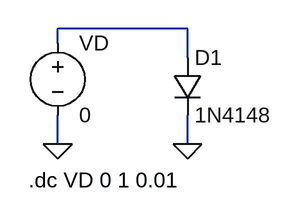
[diagram p0: schematic diode_transfer.asc]
diode_transfer.asc, the LTspice schematic file:
Version 4.1
SHEET 1 880 680
WIRE 160 160 16 160
WIRE 16 176 16 160
WIRE 160 192 160 160
WIRE 16 288 16 256
WIRE 160 288 160 256
FLAG 16 288 0
FLAG 160 288 0
SYMBOL voltage 16 160 R0
WINDOW 123 0 0 Left 0
WINDOW 39 0 0 Left 0
SYMATTR InstName VD
SYMATTR Value 0
SYMBOL diode 144 192 R0
SYMATTR InstName D1
SYMATTR Value 1N4148
TEXT -16 328 Left 2 !.dc VD 0 1 0.01

The netlist it stands for:
* diode_transfer.asc
VD N001 0 0
D1 N001 0 1N4148
.model D D
.lib standard.dio
.dc VD 0 1 0.01
.backanno
.end